# Altium schematic sheet Driver.SchDoc
size A; SheetNumber: 3; SheetTotal: 5
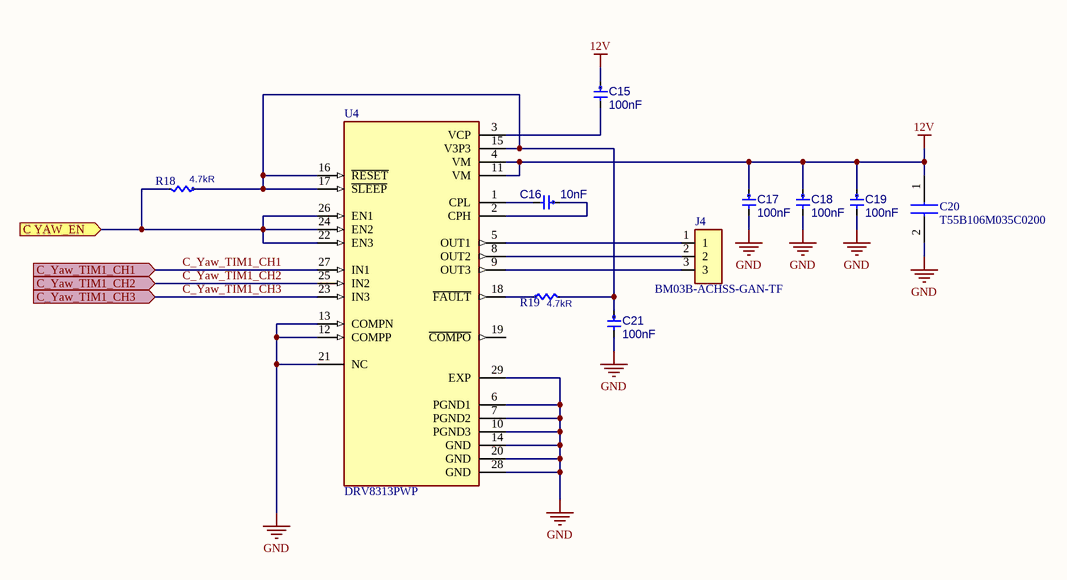
[diagram p0: Driver.SchDoc]

## Parts
C15  Capacitance: 100nF  [CAP0603]  (hidden comment: C0603C104M5RACTU)
C16  Capacitance: 10nF  [CAP0603]  (hidden comment: C0603C103M5RACTU)
C17  Capacitance: 100nF  [CAP0603]  (hidden comment: C0603C104M5RACTU)
C18  Capacitance: 100nF  [CAP0603]  (hidden comment: C0603C104M5RACTU)
C19  Capacitance: 100nF  [CAP0603]  (hidden comment: C0603C104M5RACTU)
C20  T55B106M035C0200  [T55B106M035C0200]
C21  Capacitance: 100nF  [CAP0603]  (hidden comment: C0603C104M5RACTU)
J4  BM03B-ACHSS-GAN-TF  [BM03B-ACHSS-GAN-TF]
R18  Resistance: 4.7kR  [RES0603]  (hidden comment: RC0603JR-074K7L)
R19  Resistance: 4.7kR  [RES0603]  (hidden comment: RC0603JR-074K7L)
U4  DRV8313PWP  [DRV8313PWP]

## Ports
C YAW_EN (in), C_Yaw_TIM1_CH1 (in), C_Yaw_TIM1_CH2 (in), C_Yaw_TIM1_CH3 (in)

## Nets
12V: C15.1 C17.1 C18.1 C19.1 C20.1 U4.4(VM) U4.11(VM)
GND: C17.2 C18.2 C19.2 C20.2 C21.2 U4.6(PGND1) U4.7(PGND2) U4.10(PGND3) U4.12(COMPP) U4.13(COMPN) U4.14(GND) U4.20(GND) U4.21(NC) U4.28(GND) U4.29(EXP)
C YAW_EN: R18.2 U4.22(EN3) U4.24(EN2) U4.26(EN1) ; port C YAW_EN
C_Yaw_TIM1_CH1: U4.27(IN1) ; port C_Yaw_TIM1_CH1
C_Yaw_TIM1_CH2: U4.25(IN2) ; port C_Yaw_TIM1_CH2
C_Yaw_TIM1_CH3: U4.23(IN3) ; port C_Yaw_TIM1_CH3
NetC15_2: C15.2 U4.3(VCP)
NetC16_1: C16.1 U4.2(CPH)
NetC16_2: C16.2 U4.1(CPL)
NetC21_1: C21.1 R18.1 R19.2 U4.15(V3P3) U4.16(~{RESET}) U4.17(~{SLEEP})
NetJ4_1: J4.1 U4.5(OUT1)
NetJ4_2: J4.2 U4.8(OUT2)
NetJ4_3: J4.3 U4.9(OUT3)
NetR19_1: R19.1 U4.18(~{FAULT})

Not connected (* = marked no-connect by the designer): U4 19(~{COMPO})

## Library data of the parts
C15 C17-C19 C21 = CMP-00691-1: CAP CER 0.1UF 50V X7R 0603; Manufacturer 1: KEMET; Tolerance: 20%; Dielectric Material: Ceramic; Dissipation Factor: 2.5%; Packaging: Tape and Reel; Mount: Surface Mount,PCB; Min Operating Temperature: -55°C; Case/Package: 0603; Max Operating Temperature: 125°C; Length: 1.6mm; Voltage Rating: 50V; Width: 0.031inch; Voltage Rating (DC): 50V; Dielectric: X7R; Thickness: 0.034inch; Case Code (Imperial): 0603; Case Code (Metric): 1608; Contact Plating: Tin,Matte; Depth: 0.8mm; Height: 0.8mm; Lead Pitch: 0.7mm; Manufacturer Part Number 1: C0603C104M5RACTU; Package Quantity: 1; Radiation Hardening: No; REACH SVHC: No SVHC; Termination: SMD/SMT
C16 = CMP-00691-1: CAP CER 10NF 50V X7R 0603; Manufacturer 1: KEMET; Tolerance: 20%; Dielectric Material: Ceramic; Dissipation Factor: 2.5%; Packaging: Tape and Reel; Mount: Surface Mount,PCB; Min Operating Temperature: -55°C; Case/Package: 0603; Max Operating Temperature: 125°C; Length: 1.6mm; Voltage Rating: 50V; Width: 0.031inch; Voltage Rating (DC): 50V; Dielectric: X7R; Thickness: 0.034inch; Case Code (Imperial): 0603; Case Code (Metric): 1608; Contact Plating: Tin,Matte; Depth: 0.8mm; Height: 0.8mm; Lead Pitch: 0.7mm; Manufacturer Part Number 1: C0603C103M5RACTU; Package Quantity: 1; Radiation Hardening: No; REACH SVHC: No SVHC; Termination: SMD/SMT
C20 = T55B106M035C0200: Capacitor; Manufacturer_Name: Vishay; Datasheet Link: https://www.mouser.cn/datasheet/2/427/t55-537218.pdf; Height: 2.1mm; Manufacturer_Part_Number: T55B106M035C0200; Mouser Part Number: 74-T55B106M035C0200; Mouser Price/Stock: https://www.mouser.co.uk/ProductDetail/Vishay-Polytech/T55B106M035C0200?qs=BZBei1rCqCCB8UyqeipbyQ%3D%3D; Arrow Part Number: T55B106M035C0200; Arrow Price/Stock: https://www.arrow.com/en/products/t55b106m035c0200/vishay
J4 = BM03B-ACHSS-GAN-TF: ACH Series 3 Position 1.2 mm Pitch Disconnectable Crimp Style Housing; Package: None; Price: None; Value: *; MP: BM03B-ACHSS-GAN-TF; Availability: Unavailable
R18 R19 = CMP-01404-1: RES SMD 4.7K OHM 5% 1/10W 0603; Manufacturer 1: Yageo; Voltage Rating (DC): 50V; Temperature Coefficient: 100ppm/°C; Max Power Dissipation: 100mW; Number of Terminations: 2; Width: 0.8mm; Min Operating Temperature: -55°C; Case/Package: 0603; Military Standard: Not; Termination: SMD/SMT; Manufacturer Part Number 1: RC0603JR-074K7L; Construction: Rectangular; Features: Moisture Resistant; Length: 1.6mm; Resistance Tolerance: 5%; Lead Free: Lead Free; REACH SVHC: No SVHC; Voltage Rating: 50V; Case Code (Metric): 1608; Case Code (Imperial): 0603; Packaging: Tape and Reel; Max Operating Temperature: 155°C; Size Code: 0603; Resistor Type: Thick Film; Tolerance: 5%; Number of Pins: 2; Depth: 0.8mm; Power Rating: 100mW; Series: RC
U4 = DRV8313PWP: 65-V max, 3-A peak 3-phase motor driver; MF: Texas Instruments; Package: HTSSOP-28 Texas Instruments; Price: None; Check_prices: https://www.snapeda.com/parts/DRV8313PWP/Texas+Instruments/view-part/?ref=eda; Value: *; SnapEDA_Link: https://www.snapeda.com/parts/DRV8313PWP/Texas+Instruments/view-part/?ref=snap; MP: DRV8313PWP; Availability: In Stock; Purchase-URL: https://pricing.snapeda.com/search?q=DRV8313PWP&ref=eda